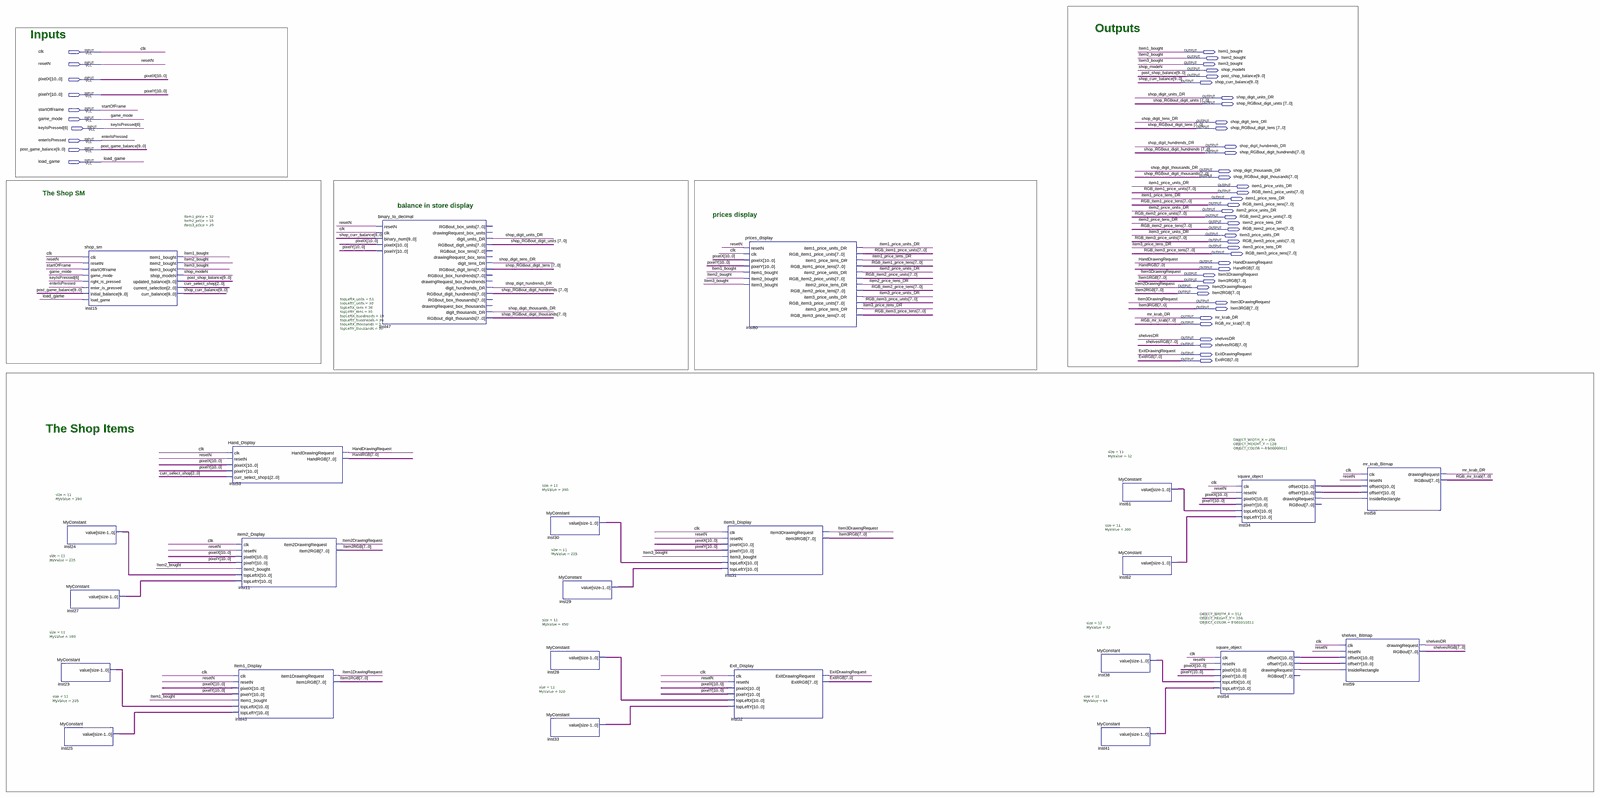
[diagram p0: schematic sheet, whole]
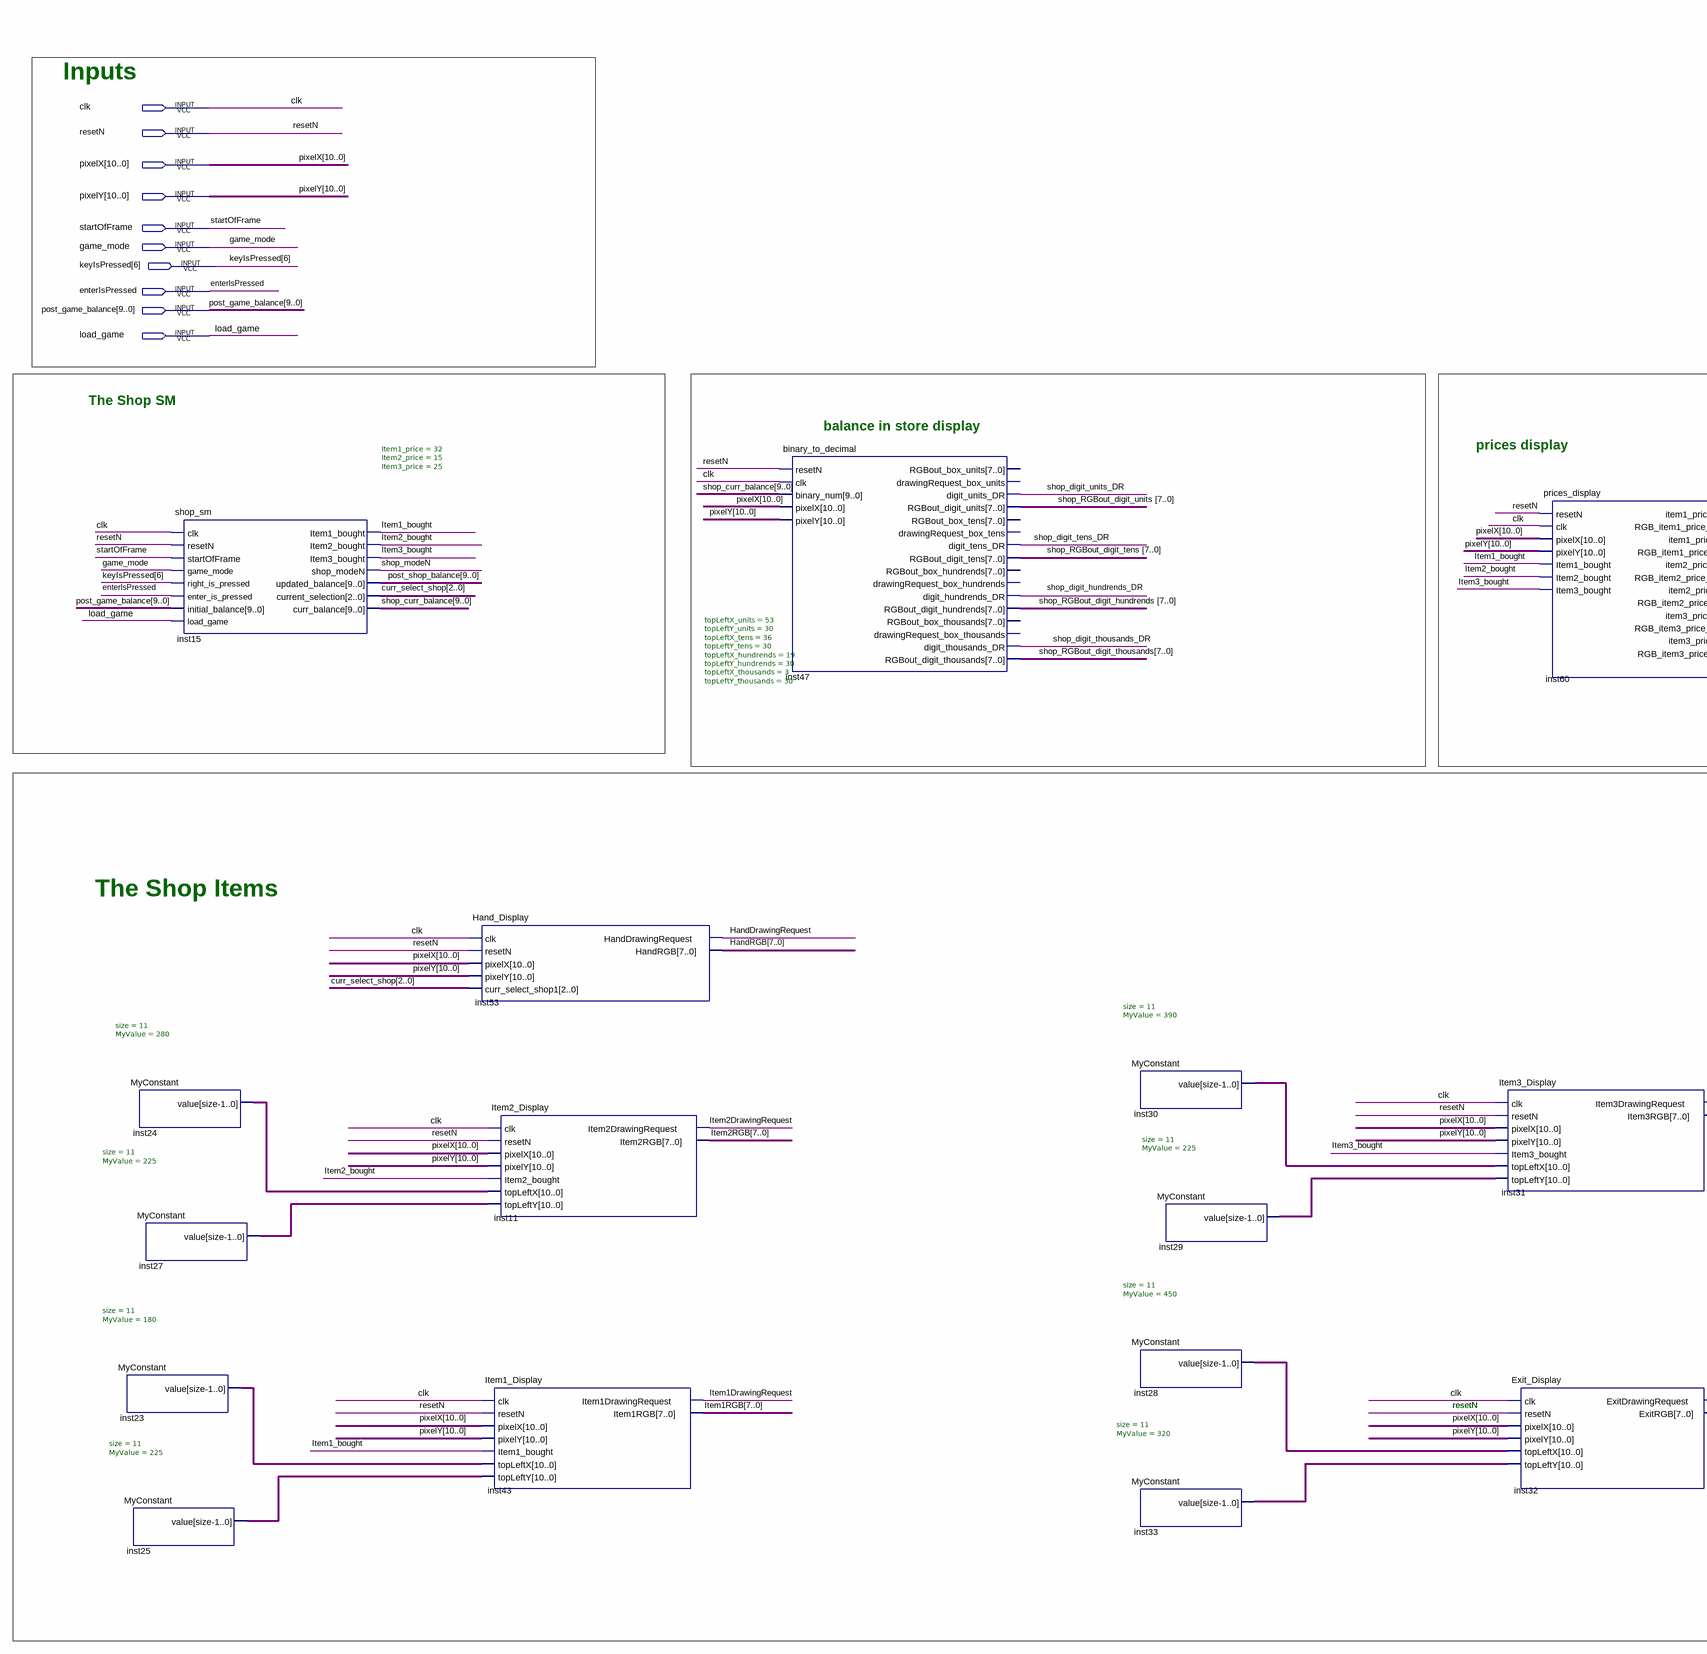
[diagram p1: schematic sheet, left part]
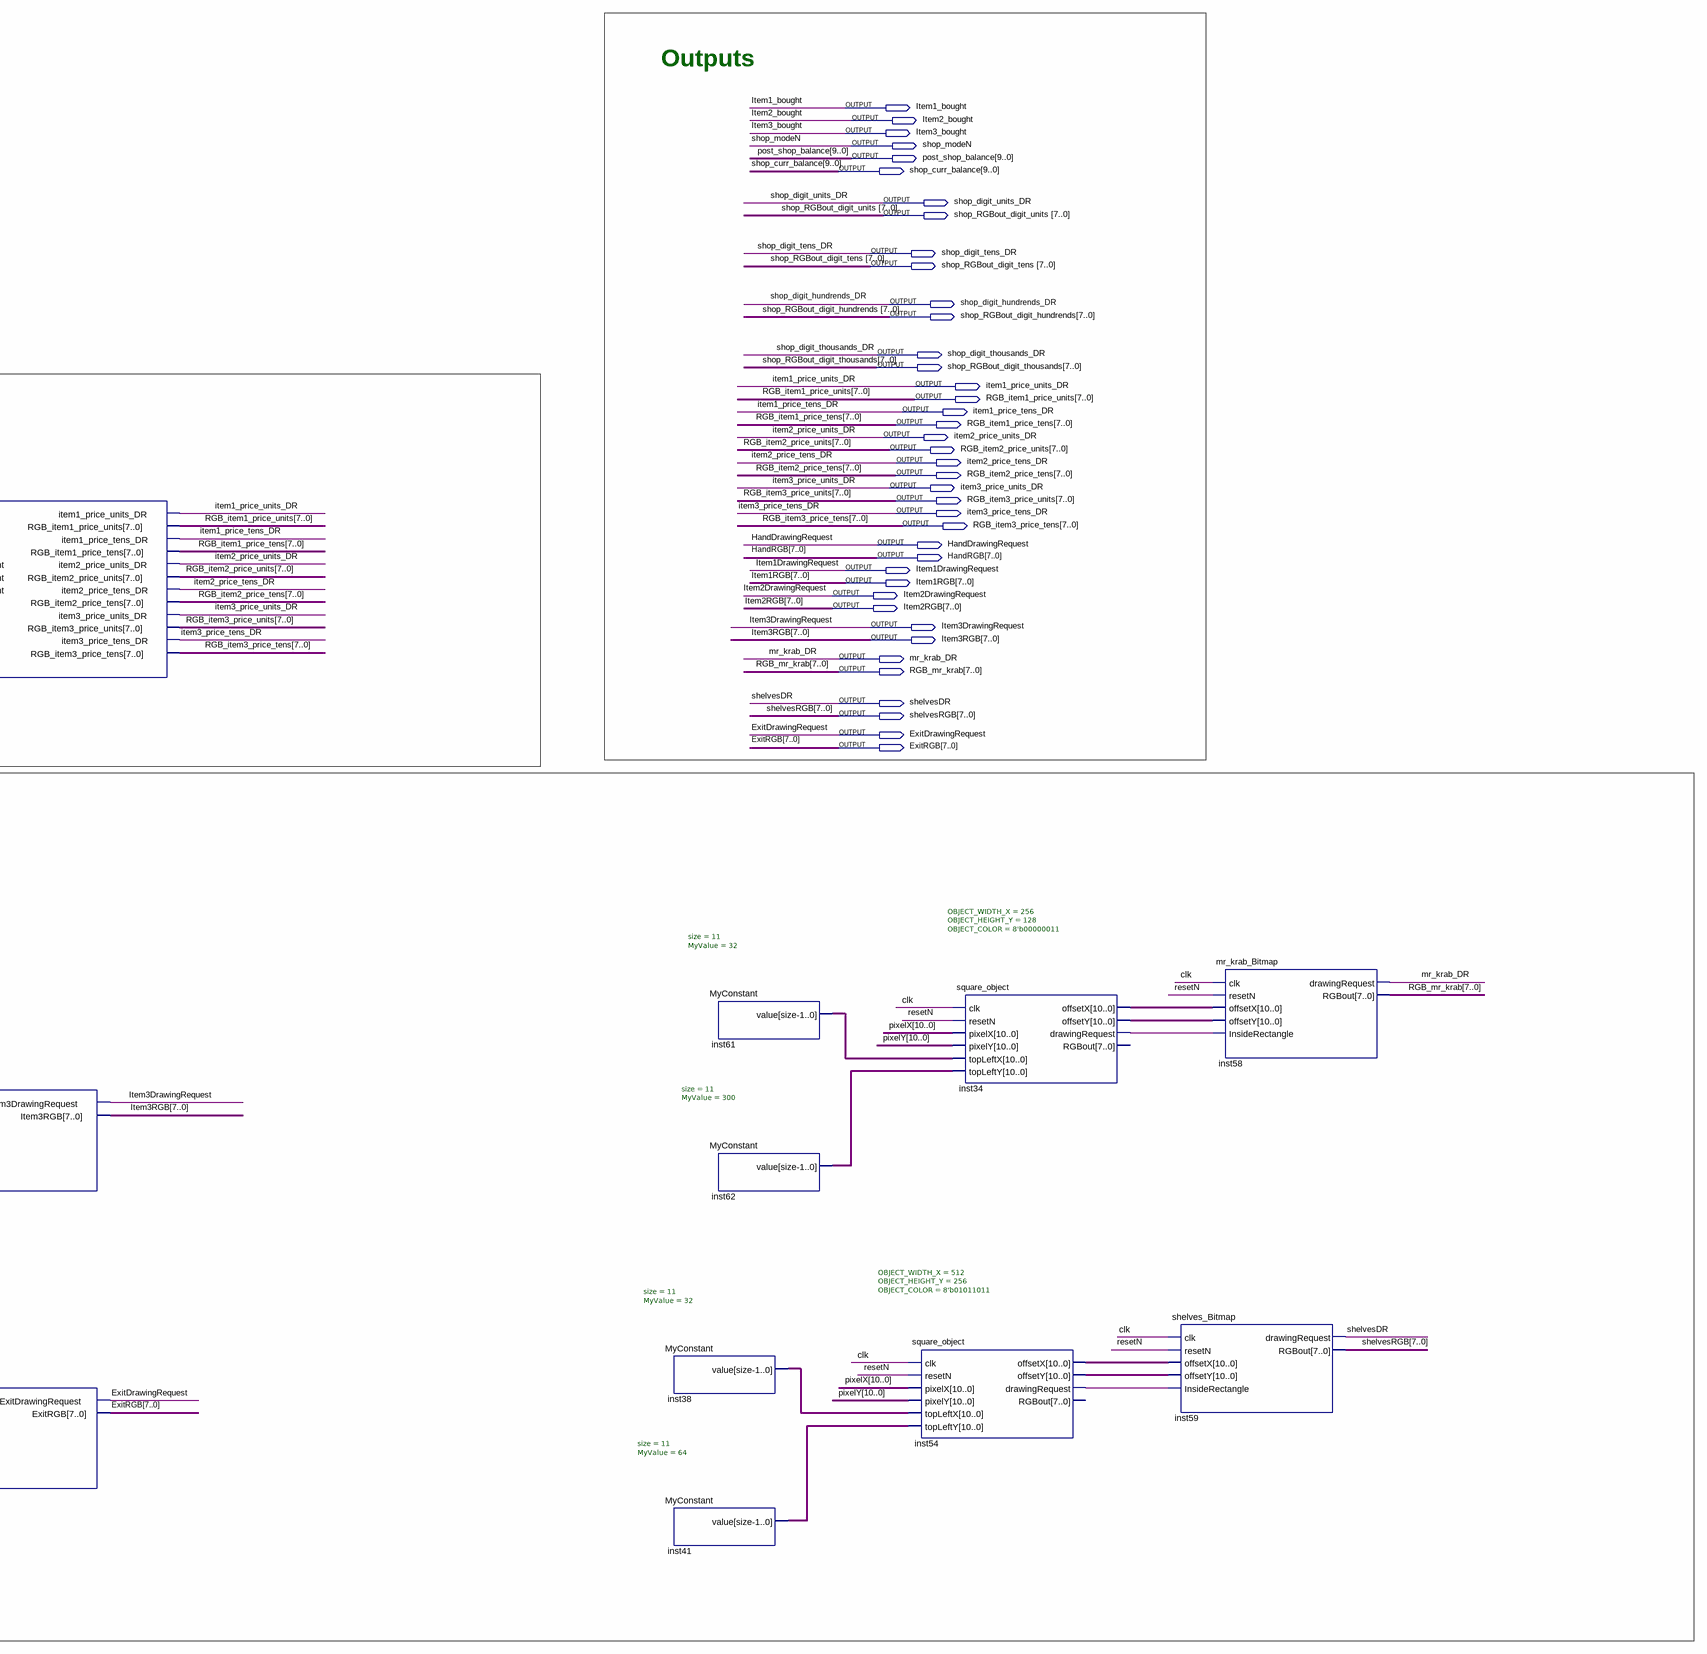
[diagram p2: schematic sheet, right part]
// Quartus schematic Shop.bdf as structural Verilog: 24 symbols, 50 pins
module Shop (
  input  clk,
  input  resetN,
  input  [10:0] pixelX,
  input  [10:0] pixelY,
  input  startOfFrame,
  input  game_mode,
  input  [6:6] keyIsPressed,
  input  enterIsPressed,
  input  [9:0] post_game_balance,
  input  load_game,
  output Item1_bought,
  output Item2_bought,
  output Item3_bought,
  output shop_modeN,
  output [9:0] post_shop_balance,
  output [9:0] shop_curr_balance,
  output shop_digit_units_DR,
  output [7:0] shop_RGBout_digit_units,
  output shop_digit_tens_DR,
  output [7:0] shop_RGBout_digit_tens,
  output shop_digit_hundrends_DR,
  output [7:0] shop_RGBout_digit_hundrends,
  output shop_digit_thousands_DR,
  output [7:0] shop_RGBout_digit_thousands,
  output item1_price_units_DR,
  output [7:0] RGB_item1_price_units,
  output item1_price_tens_DR,
  output [7:0] RGB_item1_price_tens,
  output item2_price_units_DR,
  output [7:0] RGB_item2_price_units,
  output item2_price_tens_DR,
  output [7:0] RGB_item2_price_tens,
  output item3_price_units_DR,
  output [7:0] RGB_item3_price_units,
  output item3_price_tens_DR,
  output [7:0] RGB_item3_price_tens,
  output HandDrawingRequest,
  output [7:0] HandRGB,
  output Item1DrawingRequest,
  output [7:0] Item1RGB,
  output Item2DrawingRequest,
  output [7:0] Item2RGB,
  output Item3DrawingRequest,
  output [7:0] Item3RGB,
  output mr_krab_DR,
  output [7:0] RGB_mr_krab,
  output shelvesDR,
  output [7:0] shelvesRGB,
  output ExitDrawingRequest,
  output [7:0] ExitRGB
);

  wire inst34_drawingrequest, inst54_drawingrequest;
  wire [2:0] curr_select_shop;
  wire [10:0] inst23_value, inst24_value, inst25_value, inst27_value, inst28_value, inst29_value,
       inst30_value, inst33_value, inst34_offsetx, inst34_offsety, inst38_value, inst41_value,
       inst54_offsetx, inst54_offsety, inst61_value, inst62_value;

  MyConstant #(.size(11), .MyValue(280)) inst24 (.value(inst24_value));
  MyConstant #(.size(11), .MyValue(225)) inst27 (.value(inst27_value));
  MyConstant #(.size(11), .MyValue(180)) inst23 (.value(inst23_value));
  MyConstant #(.size(11), .MyValue(225)) inst25 (.value(inst25_value));
  shop_sm #(.Item1_price(32), .Item2_price(15), .Item3_price(25)) inst15 (
    .clk(clk), .resetN(resetN), .startOfFrame(startOfFrame), .game_mode(game_mode),
    .right_is_pressed(keyIsPressed[6]), .enter_is_pressed(enterIsPressed),
    .initial_balance(post_game_balance), .load_game(load_game), .Item1_bought(Item1_bought),
    .Item2_bought(Item2_bought), .Item3_bought(Item3_bought), .shop_modeN(shop_modeN),
    .updated_balance(post_shop_balance), .current_selection(curr_select_shop),
    .curr_balance(shop_curr_balance));
  Hand_Display inst53 (
    .clk(clk), .resetN(resetN), .pixelX(pixelX), .pixelY(pixelY), .curr_select_shop1(curr_select_shop),
    .HandDrawingRequest(HandDrawingRequest), .HandRGB(HandRGB));
  Item2_Display inst11 (
    .clk(clk), .resetN(resetN), .pixelX(pixelX), .pixelY(pixelY), .Item2_bought(Item2_bought),
    .topLeftX(inst24_value), .topLeftY(inst27_value), .Item2DrawingRequest(Item2DrawingRequest),
    .Item2RGB(Item2RGB));
  Item1_Display inst43 (
    .clk(clk), .resetN(resetN), .pixelX(pixelX), .pixelY(pixelY), .Item1_bought(Item1_bought),
    .topLeftX(inst23_value), .topLeftY(inst25_value), .Item1DrawingRequest(Item1DrawingRequest),
    .Item1RGB(Item1RGB));
  binary_to_decimal #(.topLeftX_units(53), .topLeftY_units(30), .topLeftX_tens(36), .topLeftY_tens(30), .topLeftX_hundrends(19), .topLeftY_hundrends(30), .topLeftX_thousands(3), .topLeftY_thousands(30)) inst47 (
    .resetN(resetN), .clk(clk), .binary_num(shop_curr_balance), .pixelX(pixelX), .pixelY(pixelY),
    .digit_units_DR(shop_digit_units_DR), .RGBout_digit_units(shop_RGBout_digit_units),
    .digit_tens_DR(shop_digit_tens_DR), .RGBout_digit_tens(shop_RGBout_digit_tens),
    .digit_hundrends_DR(shop_digit_hundrends_DR), .RGBout_digit_hundrends(shop_RGBout_digit_hundrends),
    .digit_thousands_DR(shop_digit_thousands_DR), .RGBout_digit_thousands(shop_RGBout_digit_thousands));  // open: RGBout_box_units, drawingRequest_box_units, RGBout_box_tens, drawingRequest_box_tens, RGBout_box_hundrends, drawingRequest_box_hundrends, RGBout_box_thousands, drawingRequest_box_thousands
  MyConstant #(.size(11), .MyValue(390)) inst30 (.value(inst30_value));
  MyConstant #(.size(11), .MyValue(225)) inst29 (.value(inst29_value));
  MyConstant #(.size(11), .MyValue(450)) inst28 (.value(inst28_value));
  MyConstant #(.size(11), .MyValue(320)) inst33 (.value(inst33_value));
  Item3_Display inst31 (
    .clk(clk), .resetN(resetN), .pixelX(pixelX), .pixelY(pixelY), .Item3_bought(Item3_bought),
    .topLeftX(inst30_value), .topLeftY(inst29_value), .Item3DrawingRequest(Item3DrawingRequest),
    .Item3RGB(Item3RGB));
  Exit_Display inst32 (
    .clk(clk), .resetN(resetN), .pixelX(pixelX), .pixelY(pixelY), .topLeftX(inst28_value),
    .topLeftY(inst33_value), .ExitDrawingRequest(ExitDrawingRequest), .ExitRGB(ExitRGB));
  prices_display inst60 (
    .resetN(resetN), .clk(clk), .pixelX(pixelX), .pixelY(pixelY), .Item1_bought(Item1_bought),
    .Item2_bought(Item2_bought), .Item3_bought(Item3_bought), .item1_price_units_DR(item1_price_units_DR),
    .RGB_item1_price_units(RGB_item1_price_units), .item1_price_tens_DR(item1_price_tens_DR),
    .RGB_item1_price_tens(RGB_item1_price_tens), .item2_price_units_DR(item2_price_units_DR),
    .RGB_item2_price_units(RGB_item2_price_units), .item2_price_tens_DR(item2_price_tens_DR),
    .RGB_item2_price_tens(RGB_item2_price_tens), .item3_price_units_DR(item3_price_units_DR),
    .RGB_item3_price_units(RGB_item3_price_units), .item3_price_tens_DR(item3_price_tens_DR),
    .RGB_item3_price_tens(RGB_item3_price_tens));
  MyConstant #(.size(11), .MyValue(32)) inst38 (.value(inst38_value));
  MyConstant #(.size(11), .MyValue(64)) inst41 (.value(inst41_value));
  MyConstant #(.size(11), .MyValue(32)) inst61 (.value(inst61_value));
  MyConstant #(.size(11), .MyValue(300)) inst62 (.value(inst62_value));
  square_object #(.OBJECT_WIDTH_X(512), .OBJECT_HEIGHT_Y(256), .OBJECT_COLOR(8'b01011011)) inst54 (
    .clk(clk), .resetN(resetN), .pixelX(pixelX), .pixelY(pixelY), .topLeftX(inst38_value),
    .topLeftY(inst41_value), .offsetX(inst54_offsetx), .offsetY(inst54_offsety),
    .drawingRequest(inst54_drawingrequest));  // open: RGBout
  square_object #(.OBJECT_WIDTH_X(256), .OBJECT_HEIGHT_Y(128), .OBJECT_COLOR(8'b00000011)) inst34 (
    .clk(clk), .resetN(resetN), .pixelX(pixelX), .pixelY(pixelY), .topLeftX(inst61_value),
    .topLeftY(inst62_value), .offsetX(inst34_offsetx), .offsetY(inst34_offsety),
    .drawingRequest(inst34_drawingrequest));  // open: RGBout
  shelves_Bitmap inst59 (
    .clk(clk), .resetN(resetN), .offsetX(inst54_offsetx), .offsetY(inst54_offsety),
    .InsideRectangle(inst54_drawingrequest), .drawingRequest(shelvesDR), .RGBout(shelvesRGB));
  mr_krab_Bitmap inst58 (
    .clk(clk), .resetN(resetN), .offsetX(inst34_offsetx), .offsetY(inst34_offsety),
    .InsideRectangle(inst34_drawingrequest), .drawingRequest(mr_krab_DR), .RGBout(RGB_mr_krab));

  // Notes on the sheet:
  //   Outputs
  //   Inputs
  //   The Shop SM
  //   balance in store display
  //   prices display
  //   The Shop Items
  //   resetN
endmodule
